# EasyEDA Pro project ProPrj_Circular_Weaving_2025-12-15.epro

# Schematic Schematic1
Board Name: Board1; Create Date: 2025-12-03; Page Name: P1; Project Name: Circular_Weaving; Schematic Name: Schematic1; Update Date: 2025-12-14; Company: 嘉立创EDA; Page Size: A4; Version: V1.0
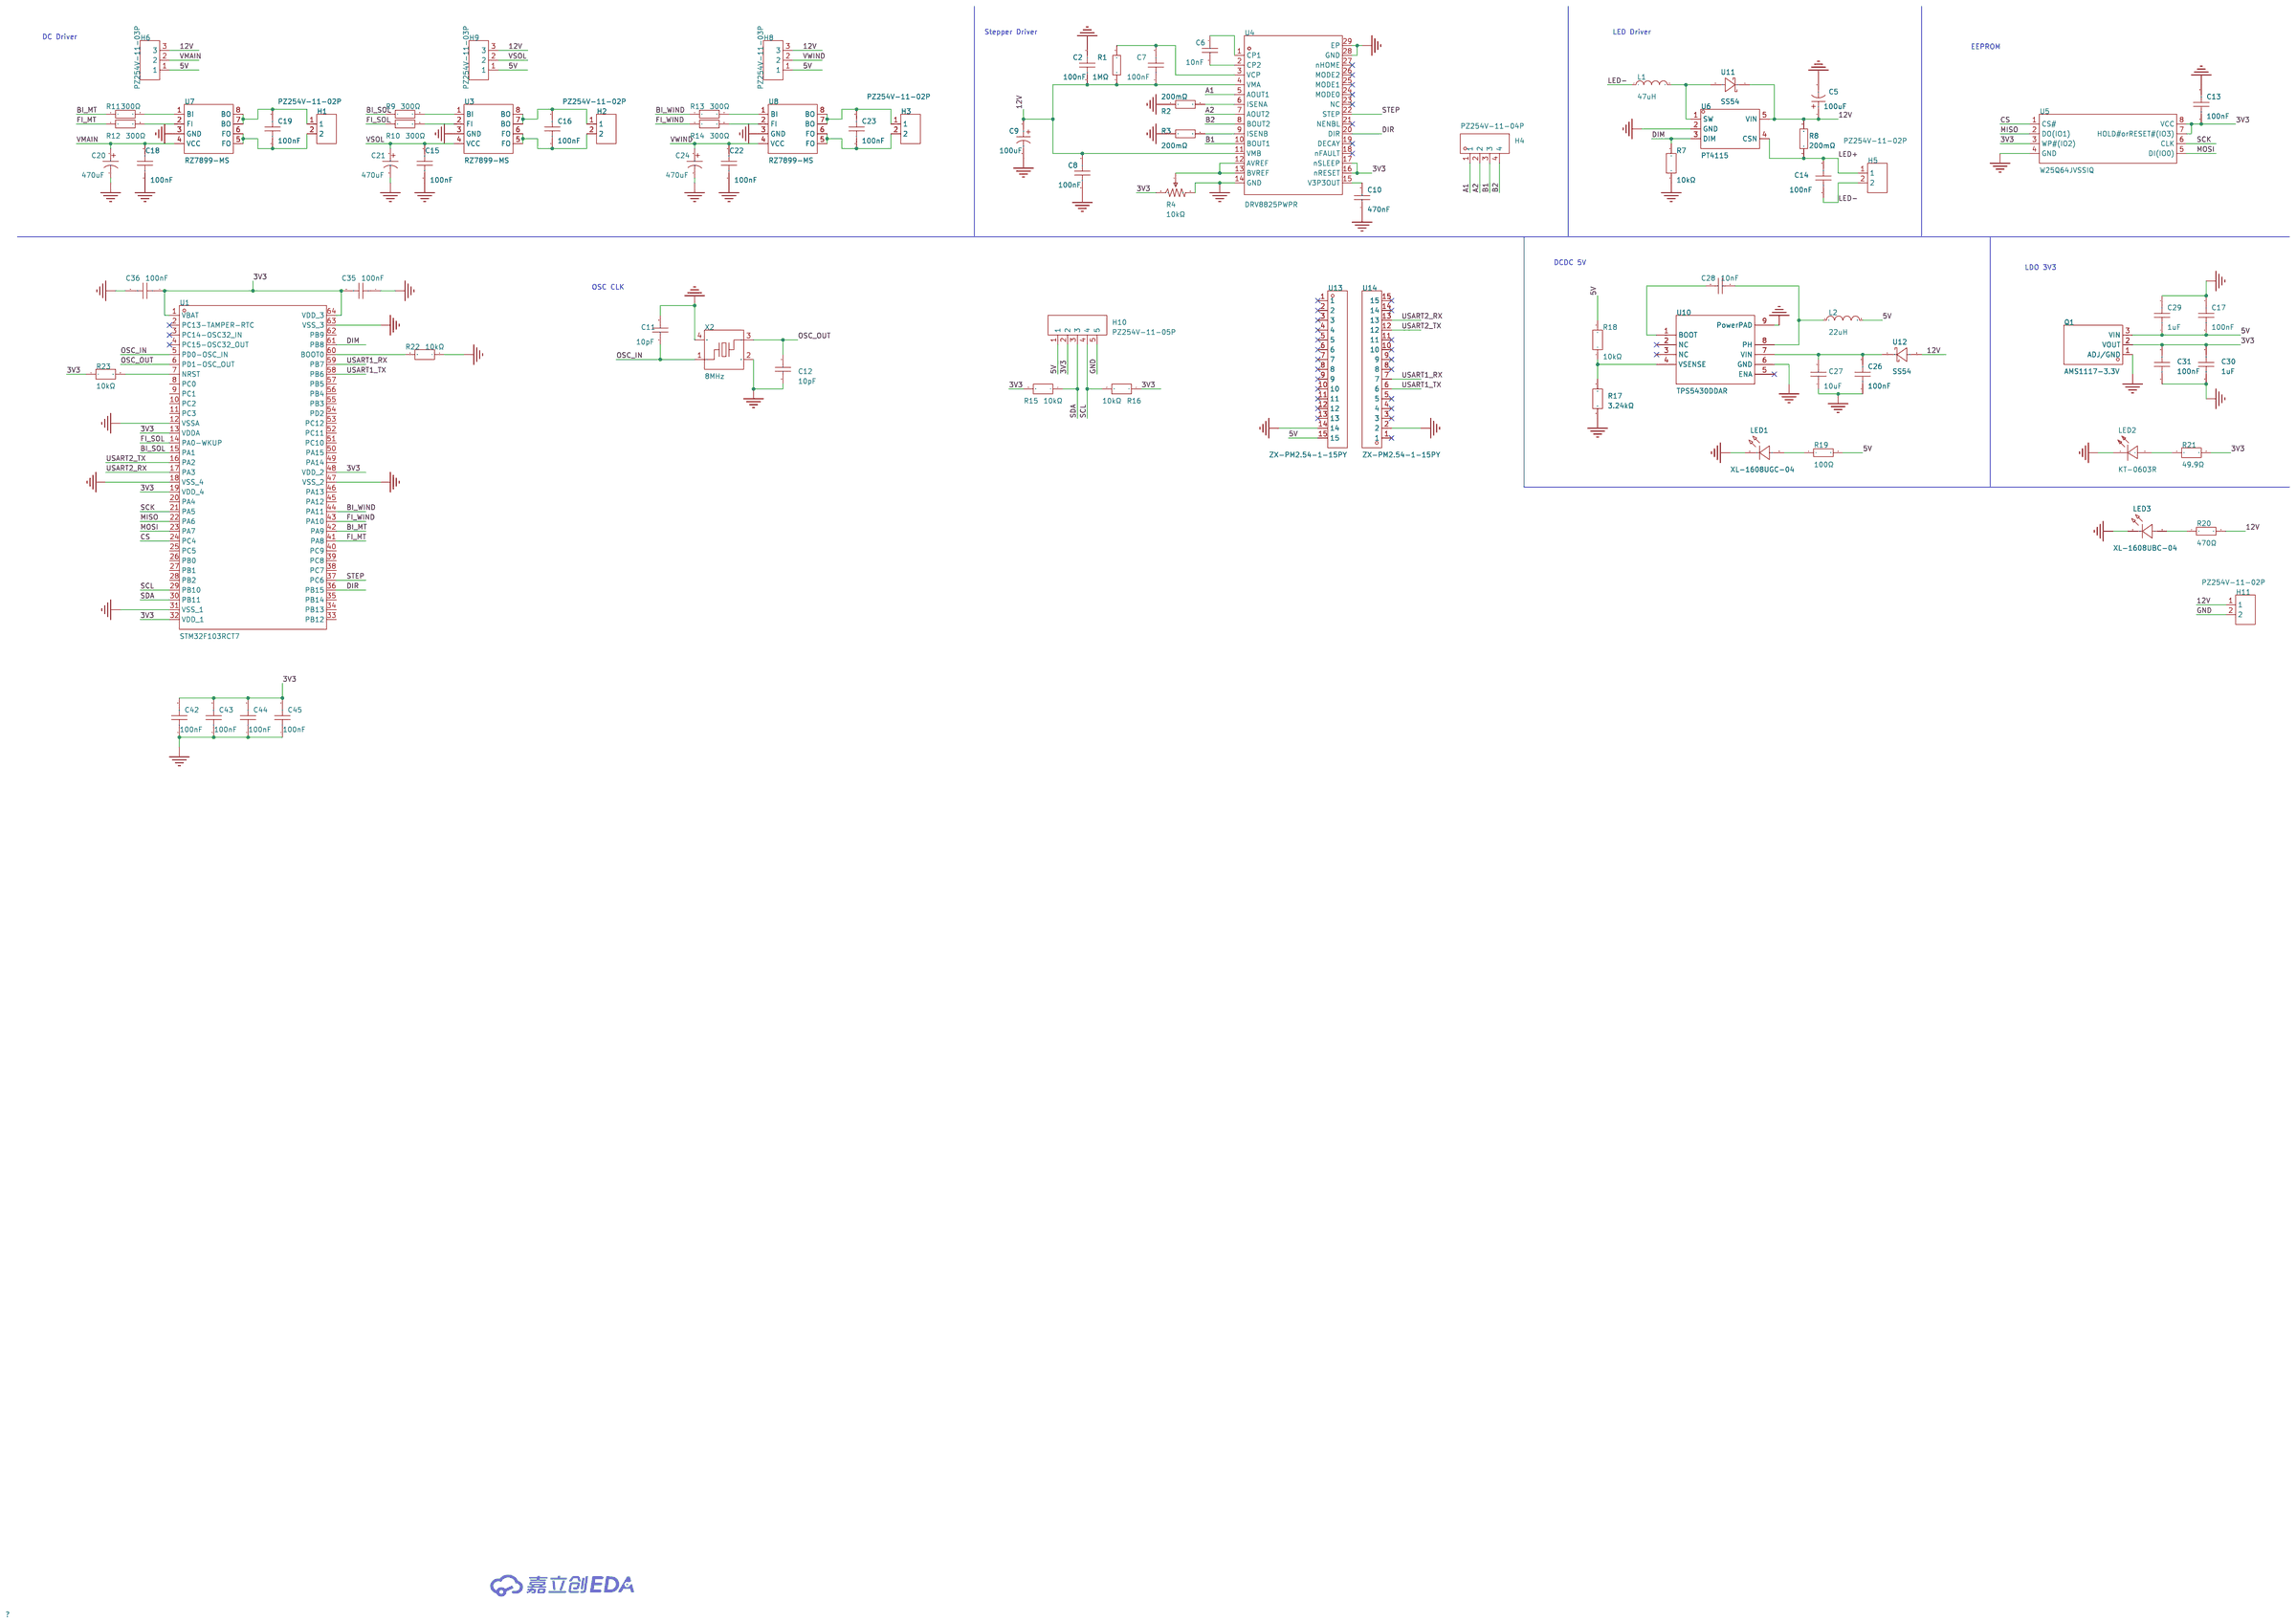
[diagram p0: schematic sheet]

## Parts
C2  100nF  [C0603]
C5  100uF  [CAP-SMD_BD6.3-L6.6-W6.6-LS7.3-FD-H7.7]
C6  10nF  [C0603]
C7  100nF  [C0603]
C8  100nF  [C0603]
C9  100uF  [CAP-SMD_BD6.3-L6.6-W6.6-LS7.3-FD-H7.7]
C10  470nF  [C0603]
C11  10pF  [C0603]
C12  10pF  [C0603]
C13  100nF  [C0603]
C14  100nF  [C0603]
C15  100nF  [C0603]
C16  100nF  [C0603]
C17  100nF  [C0603]
C18  100nF  [C0603]
C19  100nF  [C0603]
C20  470uF  [CAP-SMD_BD10.0-L10.3-W10.3-LS11.0-R-RD]
C21  470uF  [CAP-SMD_BD10.0-L10.3-W10.3-LS11.0-R-RD]
C22  100nF  [C0603]
C23  100nF  [C0603]
C24  470uF  [CAP-SMD_BD10.0-L10.3-W10.3-LS11.0-R-RD]
C26  100nF  [C0603]
C27  10uF  [C1206]
C28  10nF  [C0603]
C29  1uF  [C0603]
C30  1uF  [C0603]
C31  100nF  [C0603]
C35  100nF  [C0603]
C36  100nF  [C0603]
C42  100nF  [C0603]
C43  100nF  [C0603]
C44  100nF  [C0603]
C45  100nF  [C0603]
H1  PZ254V-11-02P  [HDR-TH_2P-P2.54-V-M]
H2  PZ254V-11-02P  [HDR-TH_2P-P2.54-V-M]
H3  PZ254V-11-02P  [HDR-TH_2P-P2.54-V-M]
H4  PZ254V-11-04P  [HDR-TH_4P-P2.54-V-M]
H5  PZ254V-11-02P  [HDR-TH_2P-P2.54-V-M]
H6  PZ254V-11-03P  [HDR-TH_3P-P2.54-V-M]
H8  PZ254V-11-03P  [HDR-TH_3P-P2.54-V-M]
H9  PZ254V-11-03P  [HDR-TH_3P-P2.54-V-M]
H10  PZ254V-11-05P  [HDR-TH_5P-P2.54-V-M]
H11  PZ254V-11-02P  [HDR-TH_2P-P2.54-V-M]
L1  47uH  [IND-SMD_L7.0-W6.6_FXL0630]
L2  22uH  [IND-SMD_L7.1-W6.6]
LED1  XL-1608UGC-04  [LED0603-RD_GREEN]
LED2  KT-0603R  [LED0603-RD]
LED3  XL-1608UBC-04  [LED0603-RD_BLUE]
Q1  AMS1117-3.3V  [SOT-89-3_L4.5-W2.5-P1.50-LS4.2-BR]
R1  1MΩ  [R0603]
R2  200mΩ  [R0603]
R3  200mΩ  [R0603]
R4  10kΩ  [RES-ADJ-SMD_JER33X-1-14]
R7  10kΩ  [R0603]
R8  200mΩ  [R0603]
R9  300Ω  [R0603]
R10  300Ω  [R0603]
R11  300Ω  [R0603]
R12  300Ω  [R0603]
R13  300Ω  [R0603]
R14  300Ω  [R0603]
R15  10kΩ  [R0603]
R16  10kΩ  [R0603]
R17  3.24kΩ  [R0603]
R18  10kΩ  [R0603]
R19  100Ω  [R0603]
R20  470Ω  [R0603]
R21  49.9Ω  [R0603]
R22  10kΩ  [R0603]
R23  10kΩ  [R0603]
U1  STM32F103RCT7  [LQFP-64_L10.0-W10.0-P0.50-LS12.0-BL]
U3  RZ7899-MS  [SOIC-8_L4.9-W3.9-P1.27-LS6.0-BL]
U4  DRV8825PWPR  [HTSSOP-28_L9.7-W4.4-P0.65-LS6.4-BL-EP]
U5  W25Q64JVSSIQ  [SOIC-8_L5.3-W5.3-P1.27-LS8.0-BL]
U6  PT4115  [SOT-89-5_L4.5-W2.5-P1.50-LS4.5-BR]
U7  RZ7899-MS  [SOIC-8_L4.9-W3.9-P1.27-LS6.0-BL]
U8  RZ7899-MS  [SOIC-8_L4.9-W3.9-P1.27-LS6.0-BL]
U10  TPS5430DDAR  [ESOP-8_L4.9-W3.9-P1.27-LS6.0-TL-EP]
U11  SS54  [SMB_L4.3-W3.6-LS5.4-RD]
U12  SS54  [SMB_L4.3-W3.6-LS5.4-RD]
U13  ZX-PM2.54-1-15PY  [HDR-TH_15P-P2.54-V-F]
U14  ZX-PM2.54-1-15PY  [HDR-TH_15P-P2.54-V-F]
X2  8MHz  [CRYSTAL-SMD_4P-L3.2-W2.5-BL]

## Library data of the parts
C2 C7 C8 C13-C19 C22 C23 C26 C31 C35 C36 C42-C45 = CL10B104KB8NNNC: 容值:100nF;精度:±10%;额定电压:50V;温度系数:X7R;; LCSC Part Name: 100nF ±10% 50V; Supplier Part: C1591; Manufacturer: SAMSUNG(三星); Supplier Footprint: 0603; JLCPCB Part Class: 扩展库; Datasheet: https://item.szlcsc.com/datasheet/CL10B104KB8NNNC/1943.html; Supplier: LCSC; Tolerance: ±10%; Voltage Rating: 50V; Temperature Coefficient: X7R
C5 C9 = JVJ50V100M6x8: 容值:100uF;精度:±20%;额定电压:50V;纹波电流:140mA@120Hz;; LCSC Part Name: 100uF ±20% 50V; Supplier Part: C46550415; Manufacturer: JIERR(捷而瑞); Supplier Footprint: SMD,D6.3xL7.7mm; JLCPCB Part Class: 扩展库; Datasheet: https://item.szlcsc.com/datasheet/JVJ50V100M6x8/48680109.html; Supplier: LCSC; Tolerance: ±20%; Voltage Rating: 50V; Ripple Current: 140mA@120Hz; Diameter: 6.3mm; Height - Seated (Max): 7.7mm; Lifetime: 2000hrs@105℃; Operating Temperature: -55℃~+105℃
C6 C28 = CC0603KRX7R9BB103: 容值:10nF;精度:±10%;额定电压:50V;温度系数:X7R;; LCSC Part Name: 10nF ±10% 50V; Supplier Part: C100042; Manufacturer: YAGEO(国巨); Supplier Footprint: 0603; JLCPCB Part Class: 扩展库; Datasheet: https://item.szlcsc.com/datasheet/CC0603KRX7R9BB103/101256.html; Supplier: LCSC; Tolerance: ±10%; Voltage Rating: 50V; Temperature Coefficient: X7R
C10 = CL10B474KA8NNNC: 容值:470nF;精度:±10%;额定电压:25V;温度系数:X7R;; LCSC Part Name: 470nF ±10% 25V; Supplier Part: C1623; Manufacturer: SAMSUNG(三星); Supplier Footprint: 0603; JLCPCB Part Class: 基础库; Datasheet: https://item.szlcsc.com/datasheet/CL10B474KA8NNNC/1975.html; Supplier: LCSC; Tolerance: ±10%; Voltage Rating: 25V; Temperature Coefficient: X7R
C11 C12 = CL10C100JB8NNNC: 容值:10pF;精度:±5%;额定电压:50V;温度系数:C0G;; LCSC Part Name: 10pF ±5% 50V; Supplier Part: C1634; Manufacturer: SAMSUNG(三星); Supplier Footprint: 0603; JLCPCB Part Class: 基础库; Datasheet: https://item.szlcsc.com/datasheet/CL10C100JB8NNNC/1986.html; Supplier: LCSC; Tolerance: ±5%; Voltage Rating: 50V; Temperature Coefficient: C0G
C20 C21 C24 = RVT1V471M1010_C72519: 容值:470uF;精度:±20%;额定电压:35V;纹波电流:286mA@120Hz;等效串联电阻(ESR):-;; LCSC Part Name: 470uF ±20% 35V; Supplier Part: C72519; Manufacturer: ROQANG(容强); Manufacturer Part: RVT1V471M1010; Supplier Footprint: SMD,D10xL10.2mm; Datasheet: https://atta.szlcsc.com/upload/public/pdf/source/20210128/C72519_A1B8ED607B11AD36B70B1D23AFC8819E.pdf; Supplier: LCSC; Tolerance: ±20%; Voltage Rating: 35V; Ripple Current: 286mA@120Hz; Diameter: 10mm; Height - Seated (Max): 10.2mm; Lifetime: 2000hrs@105℃; Operating Temperature: -40℃~+105℃
C27 = CL31A106KBHNNNE: 容值:10uF;精度:±10%;额定电压:50V;温度系数:X5R;; LCSC Part Name: 10uF ±10% 50V; Supplier Part: C13585; Manufacturer: SAMSUNG(三星); Supplier Footprint: 1206; JLCPCB Part Class: 基础库; Datasheet: https://item.szlcsc.com/datasheet/CL31A106KBHNNNE/14236.html; Supplier: LCSC; Tolerance: ±10%; Voltage Rating: 50V; Temperature Coefficient: X5R
C29 C30 = CL10A105KB8NNNC: 容值:1uF;精度:±10%;额定电压:50V;温度系数:X5R;; LCSC Part Name: 1uF ±10% 50V; Supplier Part: C15849; Manufacturer: SAMSUNG(三星); Supplier Footprint: 0603; JLCPCB Part Class: 基础库; Datasheet: https://item.szlcsc.com/datasheet/CL10A105KB8NNNC/16531.html; Supplier: LCSC; Tolerance: ±10%; Voltage Rating: 50V; Temperature Coefficient: X5R
H1-H3 H5 H11 = PZ254V-11-02P: 插针结构:1x2P;间距:2.54mm;行距:-;圆针/方针:方针;安装方式:直插;排数:单排;总PIN位数:2P;额定电流:-;额定电压:-;配合针长度:6mm;塑高:2.5mm;端接针长度:3mm;触头材质:黄铜;触头镀层:-;工作温度:-40℃~+105℃;颜色:黑色;; LCSC Part Name: 1x2P 间距:2.54mm 方针 直插; Supplier Part: C492401; Manufacturer: XFCN(兴飞); Supplier Footprint: 插件,P=2.54mm; JLCPCB Part Class: 扩展库; Datasheet: https://item.szlcsc.com/datasheet/PZ254V-11-02P/502957.html; Supplier: LCSC; Pin Structure: 1x2P; Pitch: 2.54mm; Circluar Pins/Square Pins: 方针; Mounting Type: 直插; Number of Rows: 单排; Number of Pins: 2P; Length of Mating Pin: 6mm; Insulation Height: 2.5mm; Length of End Connection Pin: 3mm; Contact Material: 黄铜; Operating Temperature: -40℃~+105℃; Color: 黑色
H4 = PZ254V-11-04P: 插针结构:1x4P;间距:2.54mm;行距:-;圆针/方针:方针;安装方式:直插;排数:单排;总PIN位数:4P;额定电流:3A;额定电压:250V;配合针长度:6mm;塑高:2.5mm;端接针长度:3mm;触头材质:-;工作温度:-40℃~+105℃;颜色:黑色;; LCSC Part Name: 1x4P 间距:2.54mm 方针 直插; Supplier Part: C2691448; Manufacturer: XFCN(兴飞); Supplier Footprint: 插件,P=2.54mm; JLCPCB Part Class: 扩展库; Datasheet: https://item.szlcsc.com/datasheet/PZ254V-11-04P/2801085.html; Supplier: LCSC; Pin Structure: 1x4P; Pitch: 2.54mm; Circluar Pins/Square Pins: 方针; Mounting Type: 直插; Number of Rows: 单排; Number of Pins: 4P; Current Rating: 3A; Voltage Rating (Max): 250V; Length of Mating Pin: 6mm; Insulation Height: 2.5mm; Length of End Connection Pin: 3mm; Operating Temperature: -40℃~+105℃; Color: 黑色
H6 H8 H9 = PZ254V-11-03P: 插针结构:1x3P;间距:2.54mm;行距:-;圆针/方针:方针;安装方式:直插;排数:单排;总PIN位数:3P;额定电流:3A;额定电压:250V;配合针长度:6mm;塑高:2.5mm;端接针长度:3mm;工作温度:-40℃~+105℃;颜色:黑色;; LCSC Part Name: 1x3P 间距:2.54mm 方针 直插; Supplier Part: C2937625; Manufacturer: XFCN(兴飞); Supplier Footprint: 插件,P=2.54mm; JLCPCB Part Class: 扩展库; Datasheet: https://item.szlcsc.com/datasheet/PZ254V-11-03P/3293280.html; Supplier: LCSC; Pin Structure: 1x3P; Pitch: 2.54mm; Circluar Pins/Square Pins: 方针; Mounting Type: 直插; Number of Rows: 单排; Number of Pins: 3P; Current Rating: 3A; Voltage Rating (Max): 250V; Length of Mating Pin: 6mm; Insulation Height: 2.5mm; Length of End Connection Pin: 3mm; Operating Temperature: -40℃~+105℃; Color: 黑色
H10 = PZ254V-11-05P: 插针结构:1x5P;间距:2.54mm;行距:-;圆针/方针:方针;安装方式:直插;排数:单排;总PIN位数:5P;额定电流:-;额定电压:-;配合针长度:6mm;塑高:2.5mm;端接针长度:3mm;触头材质:黄铜;触头镀层:-;工作温度:-40℃~+105℃;颜色:黑色;; LCSC Part Name: 1x5P 间距:2.54mm 方针 直插; Supplier Part: C492404; Manufacturer: XFCN(兴飞); Supplier Footprint: 插件,P=2.54mm; JLCPCB Part Class: 扩展库; Datasheet: https://item.szlcsc.com/datasheet/PZ254V-11-05P/502960.html; Supplier: LCSC; Pin Structure: 1x5P; Pitch: 2.54mm; Circluar Pins/Square Pins: 方针; Mounting Type: 直插; Number of Rows: 单排; Number of Pins: 5P; Length of Mating Pin: 6mm; Insulation Height: 2.5mm; Length of End Connection Pin: 3mm; Contact Material: 黄铜; Operating Temperature: -40℃~+105℃; Color: 黑色
L1 = FXL0630-470-M: 电感值:47uH;精度:±20%;额定电流:1.5A;饱和电流(Isat):2A;类型:一体成型电感;; LCSC Part Name: 47uH ±20% 2A; Supplier Part: C475913; Manufacturer: cjiang(长江微电); Supplier Footprint: SMD,6.6x7mm; JLCPCB Part Class: 扩展库; Datasheet: https://atta.szlcsc.com/upload/public/pdf/source/20240426/3189EA8206330E2108542F9E34E540E7.pdf; Supplier: LCSC; Tolerance: ±20%; Rated Current: 1.5A; Saturation Current (Isat): 2A; DC Resistance (DCR): 385mΩ; Type: 一体成型电感
L2 = YSPI0630A-220M: 电感值:22uH;精度:±20%;额定电流:3A;类型:一体成型电感;; LCSC Part Name: 22uH ±20%; Supplier Part: C497873; Manufacturer: YJYCOIN(益嘉源); Supplier Footprint: SMD,7.1x6.6mm; JLCPCB Part Class: 扩展库; Datasheet: https://item.szlcsc.com/datasheet/YSPI0630A-220M/509518.html; Supplier: LCSC; Tolerance: ±20%; Current Rating: 3A; DC Resistance(DCR): 130mΩ; Type: 一体成型电感
LED1 = XL-1608UGC-04: 灯头类型:-;发光颜色:翠绿色;正向压降(Vf):3.3V;功率:70mW;正向电流:20mA;波长:515nm~535nm;二极管配置:独立二极管;透镜颜色:无色透明透镜;色温:-;发光强度:810mcd;发光角度:120°;载带方式:正贴;工作温度:-40℃~+85℃;; LCSC Part Name: 0603翠绿贴片式发光二极管; Supplier Part: C965804; Manufacturer: XINGLIGHT(成兴光); Supplier Footprint: 0603; JLCPCB Part Class: 扩展库; Datasheet: https://item.szlcsc.com/datasheet/XL-1608UGC-04/1051413.html; Supplier: LCSC; Illumination Color: 翠绿色; Voltage - Forward(Vf): 3.3V; Power(Watts): 70mW; Forward Current: 20mA; Wavelength - Dominant: 515nm~535nm; Peak Wavelength: 525nm; Diode Configuration: 独立二极管; Lens Color: 无色透明透镜; Luminous Intensity: 810mcd; Viewing Angle: 120°; Mounting Style: 正贴; Operating Temperature: -40℃~+85℃
LED2 = KT-0603R: 发光颜色:红色;功率:-;正向电流:-;主波长:-;二极管配置:-;透镜颜色:-;色温:-;发光角度:-;载带方式:-;工作温度:-40℃~+85℃;; LCSC Part Name: 0603 红灯 高亮; Supplier Part: C2286; Manufacturer: KENTO; Supplier Footprint: 0603; JLCPCB Part Class: 基础库; Datasheet: https://atta.szlcsc.com/upload/public/pdf/source/20160616/1466072038404.pdf; Supplier: LCSC; Emitted Color: 红色; Operating Temperature: -40℃~+85℃
LED3 = XL-1608UBC-04: 灯头类型:-;发光颜色:蓝色;正向压降(Vf):3.3V;功率:70mW;正向电流:20mA;波长:455nm~475nm;二极管配置:-;透镜颜色:无色透明透镜;色温:-;发光强度:300mcd;发光角度:120°;载带方式:正贴;工作温度:-;; LCSC Part Name: 0603蓝色贴片式发光二极管; Supplier Part: C965807; Manufacturer: XINGLIGHT(成兴光); Supplier Footprint: 0603; JLCPCB Part Class: 扩展库; Datasheet: https://item.szlcsc.com/datasheet/XL-1608UBC-04/1051416.html; Supplier: LCSC; Illumination Color: 蓝色; Voltage - Forward(Vf): 3.3V; Power(Watts): 70mW; Forward Current: 20mA; Wavelength - Dominant: 455nm~475nm; Peak Wavelength: 470nm; Lens Color: 无色透明透镜; Luminous Intensity: 300mcd; Viewing Angle: 120°; Mounting Style: 正贴
Q1 = AMS1117-3.3V_C5120796: 输出类型:固定;工作电压:18V;输出电压:3.3V;输出电流:1A;输出极性:正极;; LCSC Part Name: 输入18V 输出3.3V 1A; Supplier Part: C5120796; Manufacturer: MSKSEMI(美森科); Supplier Footprint: SOT-89; JLCPCB Part Class: 扩展库; Datasheet: https://item.szlcsc.com/datasheet/AMS1117-3.3V/5706251.html; Supplier: LCSC; Output Type: 固定; Voltage - Supply: 18V; Output Voltage: 3.3V; Output Current: 1A; Voltage Dropout: 1.4V@(1A); standby current: 12mA; Operating Temperature: 0℃~+125℃; Output Configuration: 正极; Number of Outputs: 1
R1 = 0603WAF1004T5E: 电阻类型:厚膜电阻;阻值:1MΩ;精度:±1%;功率:100mW;最大工作电压:75V;温度系数:±100ppm/℃;; LCSC Part Name: 1MΩ ±1% 100mW 厚膜电阻; Supplier Part: C22935; Manufacturer: UNI-ROYAL(厚声); Supplier Footprint: 0603; JLCPCB Part Class: 基础库; Datasheet: https://atta.szlcsc.com/upload/public/pdf/source/20200306/C422600_1E6D84923E4A46A82E41ADD87F860B5C.pdf; Supplier: LCSC; Type: 厚膜电阻; Tolerance: ±1%; Power(Watts): 100mW; Overload Voltage (Max): 75V; Temperature Coefficient: ±100ppm/℃; Operating Temperature Range: -55℃~+155℃
R2 R3 R8 = 0603WAF200LT5E: 电阻类型:厚膜电阻;阻值:200mΩ;精度:±1%;功率:100mW;工作电压:75V;温度系数:±800ppm/℃;; LCSC Part Name: 200mΩ ±1% 100mW 厚膜电阻; Supplier Part: C79773; Manufacturer: UNI-ROYAL(厚声); Supplier Footprint: 0603; JLCPCB Part Class: 扩展库; Datasheet: https://item.szlcsc.com/datasheet/0603WAF200LT5E/80916.html; Supplier: LCSC; Type: 厚膜电阻; Tolerance: ±1%; Power(Watts): 100mW; Voltage-Supply(Max): 75V; Temperature Coefficient: ±800ppm/℃; Operating Temperature: -55℃~+155℃
R4 = JER33X-1-14: 阻值:10kΩ;精度:±25%;功率:150mW;温度系数:±250ppm/℃;; Supplier Part: C48997896; Manufacturer: JIERR(捷而瑞); Supplier Footprint: SMD-3P,3.4x3.1mm; JLCPCB Part Class: 扩展库; Datasheet: https://item.szlcsc.com/datasheet/JER33X-1-14/51342032.html; Supplier: LCSC; Tolerance: ±25%; Power(Watts): 150mW; Temperature Coefficient: ±250ppm/℃; Number of Turns: 1
R7 R15 R16 R18 R22 R23 = FRC0603J103 TS: 电阻类型:厚膜电阻;阻值:10kΩ;精度:±5%;功率:100mW;工作电压:75V;温度系数:±100ppm/℃;; LCSC Part Name: 10kΩ ±5% 100mW 厚膜电阻; Supplier Part: C2930027; Manufacturer: FOJAN(富捷); Supplier Footprint: 0603; JLCPCB Part Class: 扩展库; Datasheet: https://item.szlcsc.com/datasheet/FRC0603J103%2520TS/3266960.html; Supplier: LCSC; Type: 厚膜电阻; Tolerance: ±5%; Power(Watts): 100mW; Voltage-Supply(Max): 75V; Temperature Coefficient: ±100ppm/℃; Operating Temperature: -55℃~+155℃
R9-R14 = 0603WAF3000T5E: 电阻类型:厚膜电阻;阻值:300Ω;精度:±1%;功率:100mW;工作电压:75V;温度系数:±100ppm/℃;; LCSC Part Name: 300Ω ±1% 100mW 厚膜电阻; Supplier Part: C23025; Manufacturer: UNI-ROYAL(厚声); Supplier Footprint: 0603; JLCPCB Part Class: 基础库; Datasheet: https://item.szlcsc.com/datasheet/0603WAF3000T5E/23752.html; Supplier: LCSC; Type: 厚膜电阻; Tolerance: ±1%; Power(Watts): 100mW; Voltage-Supply(Max): 75V; Temperature Coefficient: ±100ppm/℃; Operating Temperature: -55℃~+155℃
R17 = FRC0603F3241TS: 电阻类型:厚膜电阻;阻值:3.24kΩ;精度:±1%;功率:100mW;工作电压:75V;温度系数:±100ppm/℃;; LCSC Part Name: 3.24kΩ ±1% 100mW 厚膜电阻; Supplier Part: C2933197; Manufacturer: FOJAN(富捷); Supplier Footprint: 0603; JLCPCB Part Class: 扩展库; Supplier: LCSC; Type: 厚膜电阻; Tolerance: ±1%; Power(Watts): 100mW; Voltage-Supply(Max): 75V; Temperature Coefficient: ±100ppm/℃; Operating Temperature: -55℃~+155℃
R19 = 0603WAF1000T5E: 电阻类型:厚膜电阻;阻值:100Ω;精度:±1%;功率:100mW;最大工作电压:75V;温度系数:±200ppm/℃;; LCSC Part Name: 100Ω ±1% 100mW 厚膜电阻; Supplier Part: C22775; Manufacturer: UNI-ROYAL(厚声); Supplier Footprint: 0603; JLCPCB Part Class: 基础库; Datasheet: https://atta.szlcsc.com/upload/public/pdf/source/20200306/C422600_1E6D84923E4A46A82E41ADD87F860B5C.pdf; Supplier: LCSC; Type: 厚膜电阻; Tolerance: ±1%; Power(Watts): 100mW; Overload Voltage (Max): 75V; Temperature Coefficient: ±200ppm/℃; Operating Temperature Range: -55℃~+155℃
R20 = 0603WAF4700T5E: 电阻类型:厚膜电阻;阻值:470Ω;精度:±1%;功率:100mW;工作电压:75V;温度系数:±100ppm/℃;; LCSC Part Name: 470Ω ±1% 100mW 厚膜电阻; Supplier Part: C23179; Manufacturer: UNI-ROYAL(厚声); Supplier Footprint: 0603; JLCPCB Part Class: 基础库; Datasheet: https://item.szlcsc.com/datasheet/0603WAF4700T5E/23906.html; Supplier: LCSC; Type: 厚膜电阻; Tolerance: ±1%; Power(Watts): 100mW; Voltage-Supply(Max): 75V; Temperature Coefficient: ±100ppm/℃; Operating Temperature: -55℃~+155℃
R21 = FRC0603F49R9TS: 电阻类型:厚膜电阻;阻值:49.9Ω;精度:±1%;功率:100mW;工作电压:75V;温度系数:±100ppm/℃;; LCSC Part Name: 49.9Ω ±1% 100mW 厚膜电阻; Supplier Part: C2930110; Manufacturer: FOJAN(富捷); Supplier Footprint: 0603; JLCPCB Part Class: 扩展库; Supplier: LCSC; Type: 厚膜电阻; Tolerance: ±1%; Power(Watts): 100mW; Voltage-Supply(Max): 75V; Temperature Coefficient: ±100ppm/℃; Operating Temperature: -55℃~+155℃
U1 = STM32F103RCT7: CPU内核:ARM-M3;CPU最大主频:72MHz;应用领域:-;; LCSC Part Name: 主流增强型ARM Cortex-M3 MCU，具有256 KB Flash、72 MHz CPU、电机控制、USB和CAN; Supplier Part: C882165; Manufacturer: ST(意法半导体); Supplier Footprint: LQFP-64(10x10); JLCPCB Part Class: 扩展库; Datasheet: https://item.szlcsc.com/datasheet/STM32F103RCT7/945876.html; Supplier: LCSC; CPU Core: ARM-M3; CPU Maximum Speed: 72MHz; Program Storage Size: 256KB; Program Memory Type: FLASH; Number of I/O: 51; ADC (Bit): 12bit; DAC (Bit): 12bit; Voltage - Supply: 2V~3.6V
U3 U7 U8 = RZ7899-MS: DC双向马达驱动芯片，采用SOP8封装，具备最大输出电流6A,工作电压3.0-30V,超低导通电阻，静态电流1UA,具有过热保护，短路保护，过流保护及紧急停止功能等。因其卓越的性能，被广泛应用于机器人、无人机、智能家居设备、电动工具、个人移动设备、玩具及各种自动化控制系统中的直流电机驱动。; Supplier Part: C22462553; Manufacturer: MSKSEMI(美森科); Supplier Footprint: SOP-8; JLCPCB Part Class: 扩展库; Datasheet: https://atta.szlcsc.com/upload/public/pdf/source/20240621/E583E2F94B562F3379D55107EB6AE7D9.pdf; Supplier: LCSC
U4 = DRV8825PWPR: DRV8825 具有电流调节功能和 1/32 微步进的 45V、2.5A 双极步进电机驱动器; LCSC Part Name: 2.5A 45V电机驱动芯片; Supplier Part: C81582; Manufacturer: TI(德州仪器); Supplier Footprint: HTSSOP-28-EP; JLCPCB Part Class: 扩展库; Datasheet: https://www.ti.com/cn/lit/gpn/drv8825; Supplier: LCSC; Interface: STEP/DIR; Step Resolution: 32; RDS(on): 200mΩ; Operating Temperature: -40℃~+85℃
U5 = W25Q64JVSSIQ: 接口类型:SPI;存储容量:64Mbit;时钟频率(fc):133MHz;; LCSC Part Name: 支持双线、四线SPI接口的3V 64Mbit 串行闪存; Supplier Part: C179171; Manufacturer: Winbond(华邦); Supplier Footprint: SOIC-8-208mil; JLCPCB Part Class: 扩展库; Datasheet: https://item.szlcsc.com/datasheet/W25Q64JVSSIQ/190565.html; Supplier: LCSC; Interface: SPI; Memory Size: 64Mbit; Clock Frequency: 133MHz; Voltage - Supply: 2.7V~3.6V; Program / Erase Cycles: 100000次; Page Programming Time (Tpp): 3ms; Block Erase Time(tBE): 150ms@(64KB); Data Retention - TDR (Year): 20年
U6 = PT4115_C347356: 类型:-;输入电压:-;开关频率:-;通道数:-;输出电压:-;输出电流:-;调光:-;; Supplier Part: C347356; Manufacturer: UMW(友台半导体); Supplier Footprint: SOT-89-5; JLCPCB Part Class: 扩展库; Datasheet: https://atta.szlcsc.com/upload/public/pdf/source/20241025/03C13C0029ED384DE85B3A39B3F7BBBE.pdf; Supplier: LCSC
U10 = TPS5430DDAR: 功能类型:降压型;工作电压:5.5V~36V;输出电压:1.221V~32.04V;输出电流:3A;输出类型:可调;; LCSC Part Name: 宽输入范围、3A输出电流的降压转换器; Supplier Part: C9864; Manufacturer: TI(德州仪器); Supplier Footprint: SOIC-8-EP; JLCPCB Part Class: 基础库; Datasheet: https://www.ti.com/lit/ds/symlink/tps5430.pdf; Supplier: LCSC; Function: 降压型; Voltage - Supply: 5.5V~36V; Output Voltage: 1.221V~32.04V; Output Current: 3A; Frequency - Switching: 500kHz; Operating Temperature: -40℃~+125℃@(TJ); Synchronous Rectifier: 否; Number of Outputs: 1; Topology: 降压式; Quiescent Current: 4.4mA; Switch tube (built-in/external): 内置; Output Type: 可调
U11 U12 = SS54_C5200096: 二极管配置:独立式;正向压降(Vf):550mV@5A;直流反向耐压(Vr):40V;整流电流:5A;; LCSC Part Name: IF:5A VR:40V VF:0.55V IFSM:150A; Supplier Part: C5200096; Manufacturer: HXY MOSFET(华轩阳电子); Supplier Footprint: SMB; JLCPCB Part Class: 扩展库; Datasheet: https://item.szlcsc.com/datasheet/SS54/5888311.html; Supplier: LCSC; Diode Configuration: 独立式; Voltage - Forward(Vf@If): 550mV@5A; Voltage - DC Reverse(Vr): 40V; Current - Rectified: 5A; Reverse Leakage Current (Ir): 500uA; Operating Junction Temperature Range: -55℃~+125℃; Non-Repetitive Peak Forward Surge Current: 150A
U13 U14 = ZX-PM2.54-1-15PY: 插孔结构:1x15P;间距:2.54mm;行距:-;圆孔/方孔:方孔;安装方式:直插;排数:单排;总孔位数:15P;额定电流:3A;额定电压:-;插孔方向:顶部;塑高:8.5mm;触头材质:黄铜;触头镀层:金;工作温度:-40℃~+105℃;; LCSC Part Name: 1x15P 间距:2.54mm 直插; Supplier Part: C7499333; Manufacturer: Megastar(兆星); Supplier Footprint: 插件,P=2.54mm; JLCPCB Part Class: 扩展库; Datasheet: https://item.szlcsc.com/datasheet/ZX-PM2.54-1-15PY/8573994.html; Supplier: LCSC; Holes Structure: 1x15P; Pitch: 2.54mm; Circular Hole / Square Hole: 方孔; Mounting Type: 直插; Number of Rows: 单排; Number of Positions: 15P; Current Rating: 3A; Holes Direction: 顶部; Insulation Height: 8.5mm; Contact Material: 黄铜; Contact Plating: 金; Operating Temperature: -40℃~+105℃; PIN Length: 3.2mm
X2 = XL2EL89CSI-KPIYLC-8M: 晶振类型:贴片晶振;频率:8MHz;常温频差:±10ppm;负载电容:20pF;频率稳定度:±20ppm;; LCSC Part Name: YSX321SL 8MHZ 4P 3225 20PF ±10PPM -40~85℃ (±20PPM); Supplier Part: C42400161; Manufacturer: YXC(扬兴晶振); Supplier Footprint: SMD3225-4P; JLCPCB Part Class: 扩展库; Datasheet: https://item.szlcsc.com/datasheet/XL2EL89CSI-KPIYLC-8M/44352056.html; Supplier: LCSC; Type: 贴片晶振; Normal temperature Frequency Tolerance: ±10ppm; Load Capacitance: 20pF; Frequency Stability: ±20ppm; Operating Temperature: -40℃~+85℃

## Nets
3V3: C13.1 C30.1 C31.2 C35.2 C36.1 C42.2 C43.2 C44.2 C45.2 H10.2 Q1.2(VOUT) R4.3 R15.2 R16.1 R21.2 R23.1 U1.1(VBAT) U1.13(VDDA) U1.19(VDD_4) U1.32(VDD_1) U1.48(VDD_2) U1.64(VDD_3) U4.16(nRESET) U4.17(nSLEEP) U5.3(WP#(IO2)) U5.7(HOLD#orRESET#(IO3)) U5.8(VCC)
5V: C17.2 C29.1 H6.1 H8.1 H9.1 H10.1 L2.2 Q1.3(VIN) R18.2 R19.2 U13.15
12V: C2.2 C5.1 C7.1 C8.1 C9.1 H6.3 H8.3 H9.3 H11.1 R1.1 R8.2 R20.2 U4.4(VMA) U4.11(VMB) U6.5(VIN) U11.1 U12.2
GND: C2.1 C5.2 C8.2 C9.2 C10.1 C11.2 C12.1 C13.2 C15.1 C17.1 C18.1 C20.2 C21.2 C22.1 C24.2 C26.1 C27.1 C29.2 C30.2 C31.1 C35.1 C36.2 C42.1 C43.1 C44.1 C45.1 H10.5 H11.2 LED1.1(K) LED2.1(K) LED3.1(K) Q1.1(ADJ/GND) R2.1 R3.1 R4.1 R7.1 R17.1 R22.1 U1.12(VSSA) U1.18(VSS_4) U1.31(VSS_1) U1.47(VSS_2) U1.63(VSS_3) U3.3(GND) U4.14(GND) U4.28(GND) U4.29(EP) U5.4(GND) U6.2(GND) U7.3(GND) U8.3(GND) U10.6(GND) U10.9(PowerPAD) U13.14 U14.2 X2.2(GND) X2.4(GND)
A1: H4.1 U4.5(AOUT1)
A2: H4.2 U4.7(AOUT2)
B1: H4.3 U4.10(BOUT1)
B2: H4.4 U4.8(BOUT2)
BI_MT: R11.1 U1.42(PA9)
BI_SOL: R9.1 U1.15(PA1)
BI_WIND: R13.1 U1.44(PA11)
CS: U1.24(PC4) U5.1(CS#)
DIM: R7.2 U1.61(PB8) U6.3(DIM)
DIR: U1.36(PB15) U4.20(DIR)
FI_MT: R12.1 U1.41(PA8)
FI_SOL: R10.1 U1.14(PA0-WKUP)
FI_WIND: R14.1 U1.43(PA10)
LED+: C14.2 H5.1 R8.1 U6.4(CSN)
LED-: C14.1 H5.2 L1.1
MISO: U1.22(PA6) U5.2(DO(IO1))
MOSI: U1.23(PA7) U5.5(DI(IO0))
OSC_IN: C11.1 U1.5(PD0-OSC_IN) X2.1
OSC_OUT: C12.2 U1.6(PD1-OSC_OUT) X2.3
SCK: U1.21(PA5) U5.6(CLK)
SCL: H10.4 R16.2 U1.29(PB10)
SDA: H10.3 R15.1 U1.30(PB11)
STEP: U1.37(PC6) U4.22(STEP)
USART1_RX: U1.59(PB7) U14.7
USART1_TX: U1.58(PB6) U14.6
USART2_RX: U1.17(PA3) U14.13
USART2_TX: U1.16(PA2) U14.12
VMAIN: C18.2 C20.1 H6.2 U7.4(VCC)
VSOL: C15.2 C21.1 H9.2 U3.4(VCC)
VWIND: C22.2 C24.1 H8.2 U8.4(VCC)
$1N2321: C6.2 U4.2(CP2)
$1N2325: C6.1 U4.1(CP1)
$1N2438: C7.2 R1.2 U4.3(VCP)
$1N2602: R2.2 U4.6(ISENA)
$1N2668: R3.2 U4.9(ISENB)
$1N2883: R4.2 U4.12(AVREF) U4.13(BVREF)
$1N3097: C10.2 U4.15(V3P3OUT)
$1N4023: L1.2 U6.1(SW) U11.2
$1N5275: R10.2 U3.2(FI)
$1N5279: R9.2 U3.1(BI)
$1N5285: C16.2 H2.1 U3.7(BO) U3.8(BO)
$1N5289: C16.1 H2.2 U3.5(FO) U3.6(FO)
$1N5836: R12.2 U7.2(FI)
$1N5842: C19.1 H1.2 U7.5(FO) U7.6(FO)
$1N5850: C19.2 H1.1 U7.7(BO) U7.8(BO)
$1N5858: R11.2 U7.1(BI)
$1N7602: C23.1 H3.2 U8.5(FO) U8.6(FO)
$1N7604: C23.2 H3.1 U8.7(BO) U8.8(BO)
$1N7613: R13.2 U8.1(BI)
$1N7614: R14.2 U8.2(FI)
$1N13952: C26.2 C27.2 U10.7(VIN) U12.1
$1N14177: C28.2 L2.1 U10.8(PH)
$1N14184: C28.1 U10.1(BOOT)
$1N14425: R17.2 R18.1 U10.4(VSENSE)
$1N14788: LED1.2(A) R19.1
$1N17021: LED3.2(A) R20.1
$1N17109: LED2.2(A) R21.1
$1N17385: R22.2 U1.60(BOOT0)
$1N21131: R23.2 U1.7(NRST)

Not connected (* = marked no-connect by the designer): U1 2(PC13-TAMPER-RTC)* 3(PC14-OSC32_IN)* 4(PC15-OSC32_OUT)* 8(PC0) 9(PC1) 10(PC2) 11(PC3) 20(PA4) 25(PC5) 26(PB0) 27(PB1) 28(PB2) 33(PB12) 34(PB13) 35(PB14) 38(PC7) 39(PC8) 40(PC9) 45(PA12) 46(PA13) 49(PA14) 50(PA15) 51(PC10) 52(PC11) 53(PC12) 54(PD2) 55(PB3) 56(PB4) 57(PB5) 62(PB9); U4 18(nFAULT)* 19(DECAY)* 21(NENBL)* 23(NC)* 24(MODE0)* 25(MODE1)* 26(MODE2)* 27(nHOME)*; U10 2(NC)* 3(NC)* 5(ENA)*; U13 1* 2* 3* 4* 5* 6* 7* 8* 9* 10* 11* 12* 13*; U14 1* 3* 4* 5* 8* 9* 10* 11* 14* 15*

## Notes on the sheet
- DC Driver
- Stepper Driver
- LED Driver
- EEPROM
- DCDC 5V
- LDO 3V3
- OSC CLK

# Board PCB1
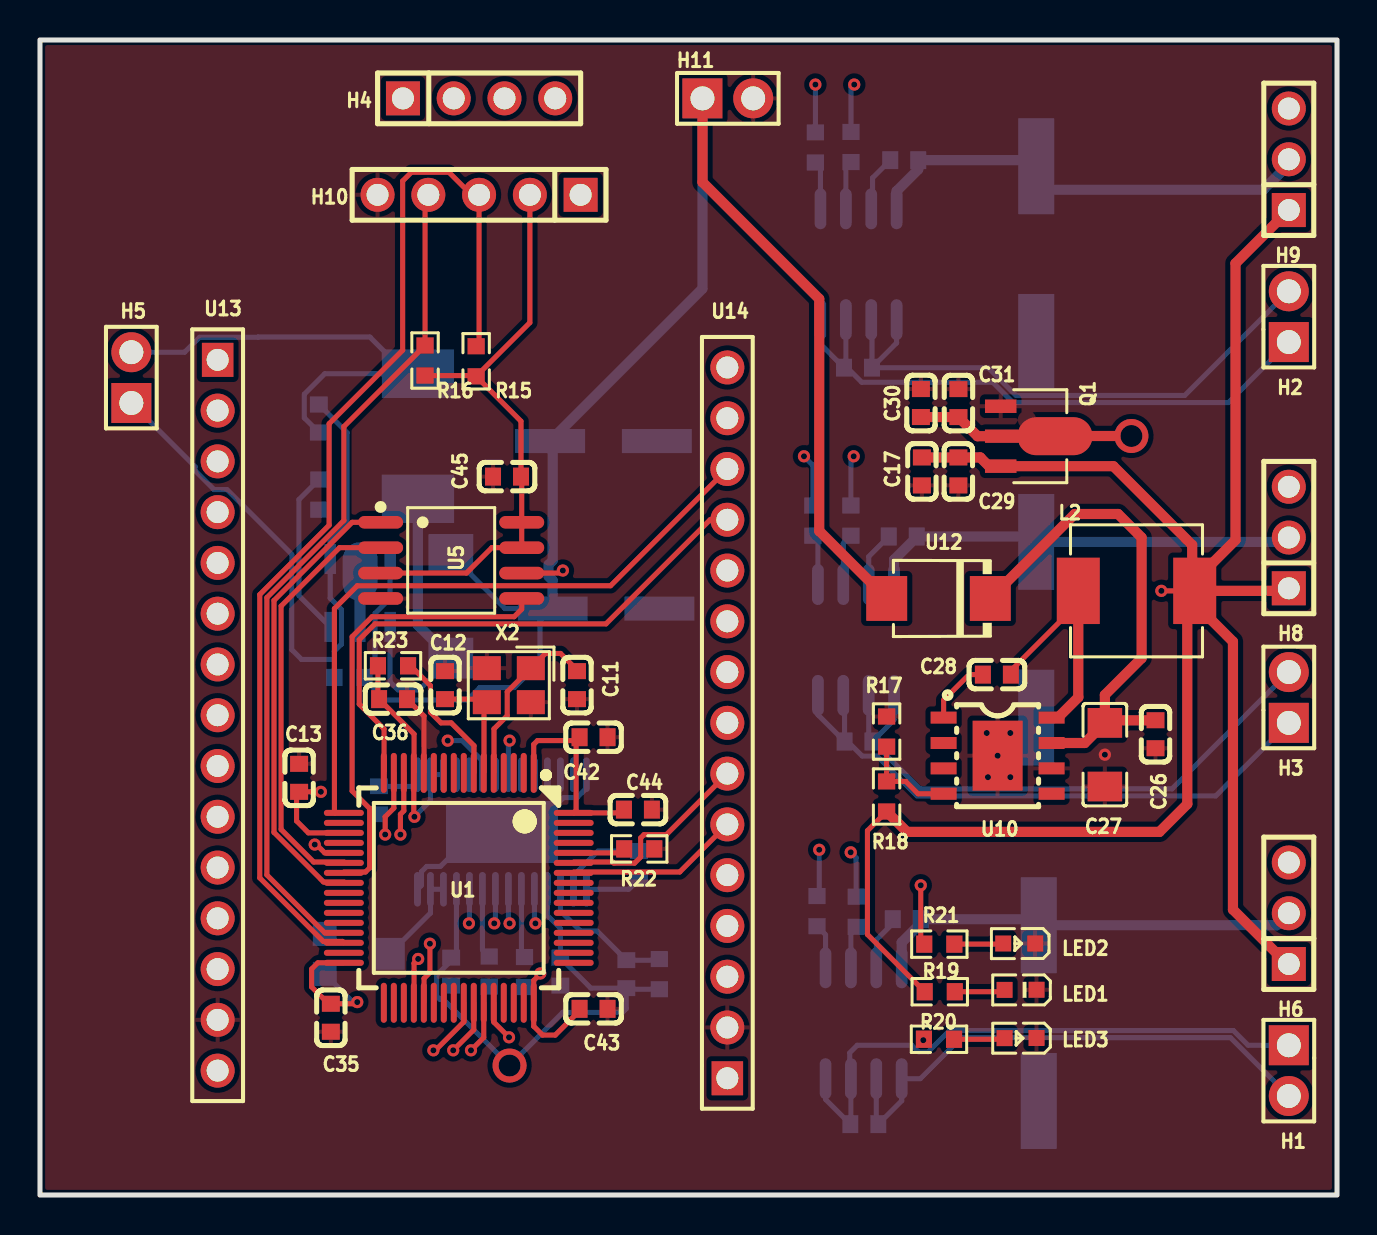
[diagram p1: board, top side]
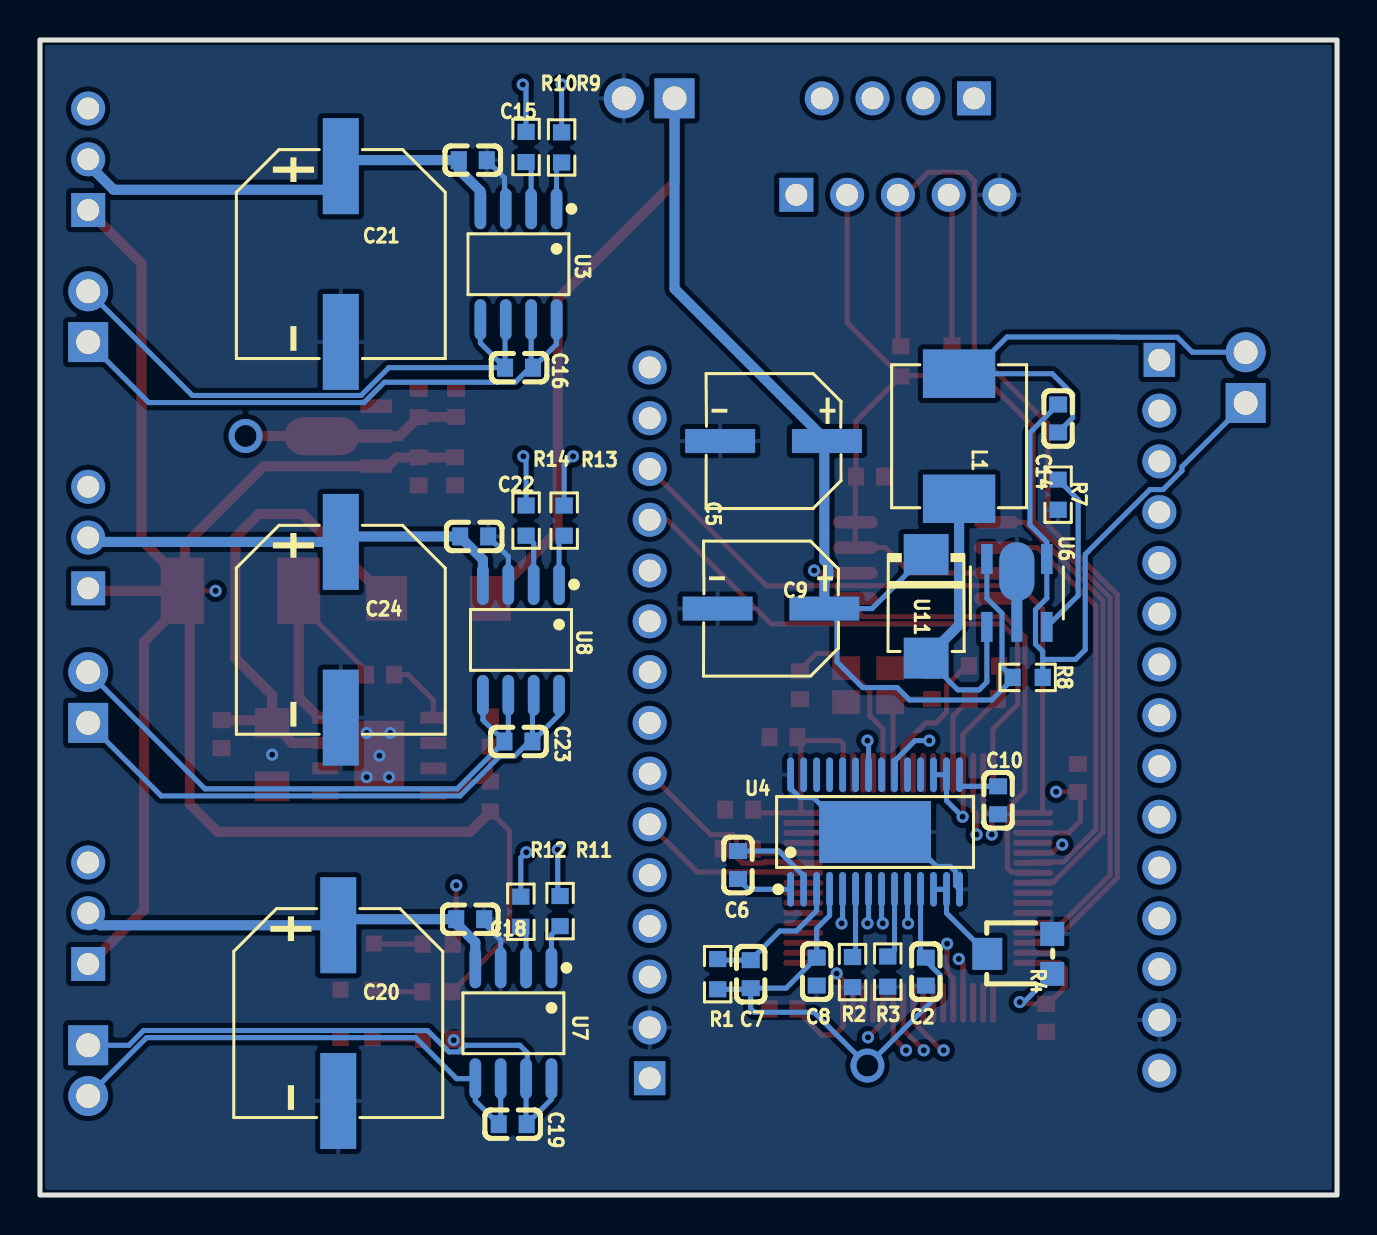
[diagram p2: board, bottom side, seen from below]

Outline 64.9 x 57.78 mm; copper layers: Top Layer, Inner1, Inner2, Inner3, Inner4, Bottom Layer. Coordinates in mm from the lower left corner of the outline.
Outline path: rectangle 0,57.78 64.9,0
Stack: Top Layer 0.035mm 外层铜厚1oz / Dielectric1 0.0994mm 3313 RC57% 4.2mil / Inner1 0.0152mm 内层铜厚 / Dielectric2 0.55mm 0.55mm H/H No copper / Inner2 0.0152mm 内层铜厚 / Dielectric3 0.1088mm 2116 RC54% 4.9mil / Inner3 0.0152mm 内层铜厚 / Dielectric4 0.55mm 0.55mm H/H No copper / Inner4 0.0152mm 内层铜厚 / Dielectric5 0.0994mm 3313 RC57% 4.2mil / Bottom Layer 0.035mm 外层铜厚1oz

## Design rules (mm)
template: JLCPCB Capability(Two Layers Board)
spacing copperThickness1oz (default): track to track 0.102, other pairs 0.152 to 0.3
spacing copperThickness2oz: track to track 0.203, other pairs 0.152 to 0.3
track width copperThickness1oz (default): min 0.127, default 0.254, max 2.54
track width copperThickness2oz: min 0.203, default 0.254, max 2.54
differential pair differentialPair (default): width min 0.127, default 0.254, max 2.54; gap min 0.152, default 0.152
via viaSize (default): diameter min 0.5, default 0.61, max 10; hole min 0.3, default 0.305, max 6.3

## Placement (name value [footprint] x y rotation side)
C2  100nF  [C0603]  20.57 11.18 90 bottom
C5  100uF  [CAP-SMD_BD6.3-L6.6-W6.6-LS7.3-FD-H7.7]  28.19 37.72 0 bottom
C6  10nF  [C0603]  29.97 16.51 90 bottom
C7  100nF  [C0603]  29.34 11.05 90 bottom
C8  100nF  [C0603]  26.03 11.18 270 bottom
C9  100uF  [CAP-SMD_BD6.3-L6.6-W6.6-LS7.3-FD-H7.7]  28.32 29.34 0 bottom
C10  470nF  [C0603]  16.96 19.75 90 bottom
C11  10pF  [C0603]  26.87 25.51 270 top
C12  10pF  [C0603]  20.27 25.51 270 top
C13  100nF  [C0603]  12.97 20.87 90 top
C14  100nF  [C0603]  13.96 38.85 90 bottom
C15  100nF  [C0603]  43.24 51.77 0 bottom
C16  100nF  [C0603]  40.93 41.39 180 bottom
C17  100nF  [C0603]  44.13 36.2 90 top
C18  100nF  [C0603]  43.37 13.8 0 bottom
C19  100nF  [C0603]  41.25 3.55 180 bottom
C20  470uF  [CAP-SMD_BD10.0-L10.3-W10.3-LS11.0-R-RD]  49.97 9.1 90 bottom
C21  470uF  [CAP-SMD_BD10.0-L10.3-W10.3-LS11.0-R-RD]  49.85 47.07 90 bottom
C22  100nF  [C0603]  43.17 32.95 0 bottom
C23  100nF  [C0603]  40.96 22.69 180 bottom
C24  470uF  [CAP-SMD_BD10.0-L10.3-W10.3-LS11.0-R-RD]  49.85 28.28 90 bottom
C26  100nF  [C0603]  55.81 23.05 90 top
C27  10uF  [C1206]  53.28 22.03 90 top
C28  10nF  [C0603]  47.88 26.03 0 top
C29  1uF  [C0603]  45.95 36.2 270 top
C30  1uF  [C0603]  44.08 39.62 90 top
C31  100nF  [C0603]  45.95 39.62 270 top
C35  100nF  [C0603]  14.55 8.87 90 top
C36  100nF  [C0603]  17.67 24.81 0 top
C42  100nF  [C0603]  27.7 22.9 180 top
C43  100nF  [C0603]  27.7 9.31 180 top
C44  100nF  [C0603]  29.92 19.28 180 top
C45  100nF  [C0603]  23.37 35.94 0 top
H1  PZ254V-11-02P  [HDR-TH_2P-P2.54-V-M]  62.48 6.22 270 top
H2  PZ254V-11-02P  [HDR-TH_2P-P2.54-V-M]  62.48 43.94 90 top
H3  PZ254V-11-02P  [HDR-TH_2P-P2.54-V-M]  62.48 24.89 90 top
H4  PZ254V-11-04P  [HDR-TH_4P-P2.54-V-M]  21.97 54.86 0 top
H5  PZ254V-11-02P  [HDR-TH_2P-P2.54-V-M]  4.57 40.89 90 top
H6  PZ254V-11-03P  [HDR-TH_3P-P2.54-V-M]  62.48 14.1 90 top
H8  PZ254V-11-03P  [HDR-TH_3P-P2.54-V-M]  62.48 32.89 90 top
H9  PZ254V-11-03P  [HDR-TH_3P-P2.54-V-M]  62.48 51.82 90 top
H10  PZ254V-11-05P  [HDR-TH_5P-P2.54-V-M]  21.97 50.04 180 top
H11  PZ254V-11-02P  [HDR-TH_2P-P2.54-V-M]  34.42 54.86 0 top
L1  47uH  [IND-SMD_L7.0-W6.6_FXL0630]  18.91 37.96 90 bottom
L2  22uH  [IND-SMD_L7.1-W6.6]  54.86 30.23 0 top
LED1  XL-1608UGC-04  [LED0603-RD_GREEN]  49.06 10.27 180 top
LED2  KT-0603R  [LED0603-RD]  49 12.58 180 top
LED3  XL-1608UBC-04  [LED0603-RD_BLUE]  49.06 7.85 180 top
Q1  AMS1117-3.3V  [SOT-89-3_L4.5-W2.5-P1.50-LS4.2-BR]  49.43 37.96 180 top
R1  1MΩ  [R0603]  30.99 11.05 90 bottom
R2  200mΩ  [R0603]  24.24 11.15 90 bottom
R3  200mΩ  [R0603]  22.48 11.18 90 bottom
R4  10kΩ  [RES-ADJ-SMD_JER33X-1-14]  15.88 12.06 90 bottom
R7  10kΩ  [R0603]  13.96 35.04 90 bottom
R8  200mΩ  [R0603]  15.48 25.89 0 bottom
R9  300Ω  [R0603]  38.8 52.41 270 bottom
R10  300Ω  [R0603]  40.58 52.43 270 bottom
R11  300Ω  [R0603]  38.88 14.2 270 bottom
R12  300Ω  [R0603]  40.84 14.17 270 bottom
R13  300Ω  [R0603]  38.67 33.74 270 bottom
R14  300Ω  [R0603]  40.57 33.74 270 bottom
R15  10kΩ  [R0603]  21.82 41.71 270 top
R16  10kΩ  [R0603]  19.27 41.75 90 top
R17  3.24kΩ  [R0603]  42.36 23.19 270 top
R18  10kΩ  [R0603]  42.36 19.94 270 top
R19  100Ω  [R0603]  45.02 10.17 180 top
R20  470Ω  [R0603]  44.98 7.79 180 top
R21  49.9Ω  [R0603]  45 12.55 180 top
R22  10kΩ  [R0603]  29.98 17.32 180 top
R23  10kΩ  [R0603]  17.66 26.48 0 top
U1  STM32F103RCT7  [LQFP-64_L10.0-W10.0-P0.50-LS12.0-BL]  20.96 15.37 180 top
U3  RZ7899-MS  [SOIC-8_L4.9-W3.9-P1.27-LS6.0-BL]  40.96 46.57 0 bottom
U4  DRV8825PWPR  [HTSSOP-28_L9.7-W4.4-P0.65-LS6.4-BL-EP]  23.11 18.16 180 bottom
U5  W25Q64JVSSIQ  [SOIC-8_L5.3-W5.3-P1.27-LS8.0-BL]  20.57 31.75 270 top
U6  PT4115  [SOT-89-5_L4.5-W2.5-P1.50-LS4.5-BR]  16.02 30.12 270 bottom
U7  RZ7899-MS  [SOIC-8_L4.9-W3.9-P1.27-LS6.0-BL]  41.21 8.59 0 bottom
U8  RZ7899-MS  [SOIC-8_L4.9-W3.9-P1.27-LS6.0-BL]  40.83 27.77 0 bottom
U10  TPS5430DDAR  [ESOP-8_L4.9-W3.9-P1.27-LS6.0-TL-EP]  47.91 21.98 0 top
U11  SS54  [SMB_L4.3-W3.6-LS5.4-RD]  20.56 29.45 270 bottom
U12  SS54  [SMB_L4.3-W3.6-LS5.4-RD]  44.96 29.84 180 top
U13  ZX-PM2.54-1-15PY  [HDR-TH_15P-P2.54-V-F]  8.89 24 270 top
U14  ZX-PM2.54-1-15PY  [HDR-TH_15P-P2.54-V-F]  34.39 23.62 90 top
X2  8MHz  [CRYSTAL-SMD_4P-L3.2-W2.5-BL]  23.46 25.51 180 top

## Footprints (pads in the part's own frame, mm; a bottom-side part is the same pattern mirrored in y, then rotated)
C0603
  rect 0.8x0.9 smd: 1(-0.7,0) 2(0.7,0)
C1206
  rect 1.485x1.728 smd: 1(-1.593,0) 2(1.593,0)
CAP-SMD_BD6.3-L6.6-W6.6-LS7.3-FD-H7.7
  rect 3.5x1.2 smd: 1(-2.67,0) 2(2.67,0)
CAP-SMD_BD10.0-L10.3-W10.3-LS11.0-R-RD
  rect 4.8x1.8 smd: 1(4.395,0) 2(-4.395,0)
CRYSTAL-SMD_4P-L3.2-W2.5-BL
  rect 1.4x1.2 smd: 1(-1.1,-0.85) 2(1.1,-0.85) 3(1.1,0.85) 4(-1.1,0.85)
ESOP-8_L4.9-W3.9-P1.27-LS6.0-TL-EP
  rect 1.3x0.6 smd: 1(-2.7,1.905) 2(-2.7,0.635) 3(-2.7,-0.635) 4(-2.7,-1.905) 5(2.7,-1.905) 6(2.7,-0.635) 7(2.7,0.635) 8(2.7,1.905)
  rect 2.5x3.5 smd: 9(0,0)
HDR-TH_2P-P2.54-V-M
  rect 2x2 hole 1.2: 1(-1.27,0)
  round 2 hole 1.2: 2(1.27,0)
HDR-TH_3P-P2.54-V-M
  rect 1.7x1.7 hole 1.1: 1(-2.54,0)
  round 1.7 hole 1.1: 2(0,0) 3(2.54,0)
HDR-TH_4P-P2.54-V-M
  rect 1.7x1.7 hole 1.1: 1(-3.81,0)
  round 1.7 hole 1.1: 2(-1.27,0) 3(1.27,0) 4(3.81,0)
HDR-TH_5P-P2.54-V-M
  rect 1.7x1.7 hole 1.1: 1(-5.08,0)
  round 1.7 hole 1.1: 2(-2.54,0) 3(0,0) 4(2.54,0) 5(5.08,0)
HDR-TH_15P-P2.54-V-F
  rect 1.7x1.575 hole 1.1: 1(-17.78,0)
  round 1.7 hole 1.1: 2(-15.24,0) 3(-12.7,0) 4(-10.16,0) 5(-7.62,0) 6(-5.08,0) 7(-2.54,0) 8(0,0) 9(2.54,0) 10(5.08,0) 11(7.62,0) 12(10.16,0) 13(12.7,0) 14(15.24,0) 15(17.78,0)
HTSSOP-28_L9.7-W4.4-P0.65-LS6.4-BL-EP
  oval 0.343x1.732 smd: 1(-4.225,-2.866) 2(-3.575,-2.866) 3(-2.925,-2.866) 4(-2.275,-2.866) 5(-1.625,-2.866) 6(-0.975,-2.866) 7(-0.325,-2.866) 8(0.325,-2.866) 9(0.975,-2.866) 10(1.625,-2.866) 11(2.275,-2.866) 12(2.925,-2.866) 13(3.575,-2.866) 14(4.225,-2.866) 15(4.225,2.866) 16(3.575,2.866) 17(2.925,2.866) 18(2.275,2.866) 19(1.625,2.866) 20(0.975,2.866) 21(0.325,2.866) 22(-0.325,2.866) 23(-0.975,2.866) 24(-1.625,2.866) 25(-2.275,2.866) 26(-2.925,2.866) 27(-3.575,2.866) 28(-4.225,2.866)
  rect 5.6x3.1 smd: 29(0,0)
IND-SMD_L7.0-W6.6_FXL0630
  rect 2.424x3.62 smd: 1(3.128,0) 2(-3.128,0)
IND-SMD_L7.1-W6.6
  rect 2.15x3.32 smd: 1(-2.913,0) 2(2.913,0)
LED0603-RD
  rect 0.8x0.8 smd: 1(-0.799,0) 2(0.799,0)
LED0603-RD_BLUE
  rect 0.8x0.8 smd: 1(-0.799,-0.004) 2(0.799,0.004)
LED0603-RD_GREEN
  rect 0.8x0.8 smd: 1(-0.799,-0.004) 2(0.799,0.004)
LQFP-64_L10.0-W10.0-P0.50-LS12.0-BL
  oval 0.3x2 smd: 1(-3.75,-5.75) 2(-3.25,-5.75) 3(-2.75,-5.75) 4(-2.25,-5.75) 5(-1.75,-5.75) 6(-1.25,-5.75) 7(-0.75,-5.75) 8(-0.25,-5.75) 9(0.25,-5.75) 10(0.75,-5.75) 11(1.25,-5.75) 12(1.75,-5.75) 13(2.25,-5.75) 14(2.75,-5.75) 15(3.25,-5.75) 16(3.75,-5.75) 33(3.75,5.75) 34(3.25,5.75) 35(2.75,5.75) 36(2.25,5.75) 37(1.75,5.75) 38(1.25,5.75) 39(0.75,5.75) 40(0.25,5.75) 41(-0.25,5.75) 42(-0.75,5.75) 43(-1.25,5.75) 44(-1.75,5.75) 45(-2.25,5.75) 46(-2.75,5.75) 47(-3.25,5.75) 48(-3.75,5.75)
  oval 2x0.3 smd: 17(5.75,-3.75) 18(5.75,-3.25) 19(5.75,-2.75) 20(5.75,-2.25) 21(5.75,-1.75) 22(5.75,-1.25) 23(5.75,-0.75) 24(5.75,-0.25) 25(5.75,0.25) 26(5.75,0.75) 27(5.75,1.25) 28(5.75,1.75) 29(5.75,2.25) 30(5.75,2.75) 31(5.75,3.25) 32(5.75,3.75) 49(-5.75,3.75) 50(-5.75,3.25) 51(-5.75,2.75) 52(-5.75,2.25) 53(-5.75,1.75) 54(-5.75,1.25) 55(-5.75,0.75) 56(-5.75,0.25) 57(-5.75,-0.25) 58(-5.75,-0.75) 59(-5.75,-1.25) 60(-5.75,-1.75) 61(-5.75,-2.25) 62(-5.75,-2.75) 63(-5.75,-3.25) 64(-5.75,-3.75)
R0603
  rect 0.806x0.864 smd: 1(-0.753,0) 2(0.753,0)
RES-ADJ-SMD_JER33X-1-14
  rect 1.2x1.2 smd: 1(1,-1.625) 3(-1,-1.625)
  rect 1.6x1.5 smd: 2(0,1.625)
SMB_L4.3-W3.6-LS5.4-RD
  rect 2.047x2.241 smd: 1(-2.591,0) 2(2.591,0)
SOIC-8_L4.9-W3.9-P1.27-LS6.0-BL
  oval 0.588x2.045 smd: 1(-1.905,-2.772) 2(-0.635,-2.772) 3(0.635,-2.772) 4(1.905,-2.772) 5(1.905,2.772) 6(0.635,2.772) 7(-0.635,2.772) 8(-1.905,2.772)
SOIC-8_L5.3-W5.3-P1.27-LS8.0-BL
  oval 0.63x2.25 smd: 1(-1.905,-3.53) 2(-0.635,-3.53) 3(0.635,-3.53) 4(1.905,-3.53) 5(1.905,3.53) 6(0.635,3.53) 7(-0.635,3.53) 8(-1.905,3.53)
SOT-89-3_L4.5-W2.5-P1.50-LS4.2-BR
  rect 1.575x0.672 smd: 1(1.356,-1.5) 3(1.356,1.5)
  custom 5.377x1.9 smd: 2(-1.356,0)
SOT-89-5_L4.5-W2.5-P1.50-LS4.5-BR
  rect 1.5x0.574 smd: 1(1.698,-1.5) 3(1.698,1.5) 4(-1.698,1.5) 5(-1.698,-1.5)
  oval 2.94x1.76 smd: 2(-1.067,0)
  rect 2.209x0.552 smd: 2(1.343,0)

## Nets
As in the schematic.

Pads without a net: U1 2 3 4 8 9 10 11 20 25 26 27 28 33 34 35 38 39 40 45 46 49 50 51 52 53 54 55 56 57 62; U4 18 19 21 23 24 25 26 27; U10 2 3 5; U13 1 2 3 4 5 6 7 8 9 10 11 12 13; U14 1 3 4 5 8 9 10 11 14 15

## Via types
v1: diameter 0.61, hole 0.305, Top Layer to Bottom Layer, 35 vias
v2: diameter 1.7, hole 1.1, Top Layer to Bottom Layer, 2 vias

## Routing (per net, layer and track width the routed paths; a pad name or vN(x,y) marks a point on that pad's centre or on a via; arc(x,y) is an arc through that point)
3V3: length 230
  Top Layer w0.254: 26.83,22.73 C42.2 ; 26.83,22.73 26.83,19.24 U1.64 29.06,19.12 C44.2 ; 26.83,22.73 24.89,22.73 24.71,22.55 U1.1 ; 12.84,20.04 12.84,18.71 13.43,18.12 U1.19 ; v1(14.05,20.17) C13.1 ; R16.1 21.78,41 R15.2 ; R15.2 24.51,43.64 H10.2 ; R15.2 24.07,38.71 C45.2 24.1,35.9 U5.8 U5.7 22.61,32.38 21.34,31.11 U5.3 ; v1(15.88,9.65) 15.79,9.57 C35.2 14.43,9.57 13.59,10.41 13.59,11.3 13.9,11.62 U1.32 ; C43.2 27,9.22 25.78,8 25.15,8 24.71,8.44 U1.48 24.71,10.73 25.03,11.06 v1(25.03,11.08) ; U1.13 18.71,18.95 v1(18.74,18.92) ; 18.72,21.16 18.72,23.06 C36.1 16.91,24.86 R23.1 ; R21.2 44.07,12.73 v1(44.07,15.49)
  Top Layer w0.508: v2(54.61,37.97) 50.79,37.97 Q1.2 46.91,37.96 C31.2 44.08,38.92 C30.1
  Inner3 w0.254: v2(54.61,37.97) 36.31,19.67 25.97,19.67 25.13,18.83 18.83,18.83 v1(18.74,18.92) ; v2(54.61,37.97) 54.79,38.15 56.08,38.15 57.15,37.08 57.15,28.57 v1(44.07,15.49) 39.66,11.08 35.83,11.08 34.86,12.05 33.92,12.05 32.96,11.08 v1(25.03,11.08) ; v2(54.61,37.97) 40.13,37.97 34.04,44.07 30.93,44.07 24.96,50.04 H10.2 ; v1(14.05,20.17) 16.02,20.17 17.27,18.92 v1(18.74,18.92) ; v1(18.74,18.92) 18.74,12.51 v1(15.88,9.65)
  Bottom Layer w0.254: U4.17 U4.16 19.54,19.73 v1(18.74,18.92) ; R4.3 15.66,9.65 v1(15.88,9.65)
5V: length 202.5
  Top Layer w0.254: R18.2 41.4,18.23 41.4,13.03 R19.2 ; v1(56.11,30.23) 57.48,30.23
  Top Layer w0.508: 57.78,30.23 57.48,30.23 57.4,30.15 57.4,19.56 56.01,18.17 43.38,18.17 R18.2 ; 57.78,30.23 62.36,30.23 H8.1 ; 57.78,30.23 57.78,29.6 59.69,27.69 59.69,14.28 62.41,11.56 H6.1 ; C17.2 C29.1 47.05,36.9 47.48,36.46 Q1.3 53.71,36.46 57.65,32.52 57.65,30.73 ; 57.78,30.73 59.82,32.77 59.82,46.61 62.48,49.28
  Inner2 w0.508: U13.15 11.56,3.56 35.94,3.56 56.11,23.72 v1(56.11,30.23) 36.3,50.04 H10.1
12V: length 311
  Top Layer w0.254: v1(44.2,7.75) 44.2,7.76 R20.2
  Top Layer w0.508: U12.2 38.99,33.22 38.99,44.83 33.15,50.67 H11.1
  Inner1 w0.254: v1(44.2,7.75) 53.28,7.75 62.33,16.8
  Inner1 w0.762: H11.1 35.18,56.9 59.94,56.9 H9.3 ; H11.1 31.12,52.83 31.12,48.01 H6.3 ; H11.1 33.15,54.74 37.21,50.67 47.24,50.67 H8.3 ; H11.1 33.15,54.99 31.62,56.51 29.72,56.51 28.96,55.75 28.96,12.06 23.5,6.6 v2(23.5,6.48)
  Bottom Layer w0.254: 25.25,29.34 23.27,29.34 U11.1 ; 25.25,29.34 25.25,28.96 25.02,28.73 25.02,26.67 23.74,25.39 22.01,25.39 21.38,24.76 17.28,24.76 16.23,25.81 R8.2 16.76,26.43 16.76,29.1 17.52,29.86 U6.5 ; 25.25,29.34 C9.1 ; C7.1 27.56,10.35 C8.1 26.03,13.33 25.39,13.98 U4.4 ; C7.1 29.34,9.32 29.16,9.14 26.16,9.14 v2(23.5,6.48) 20.18,9.8 20.01,9.8 19.84,9.96 19.84,10.99 20.57,11.72 C2.2 20.64,11.88 20.84,12.08 U4.11 ; C7.1 29.39,10.3 R1.1
  Bottom Layer w0.508: C9.1 25.65,30.75 25.45,30.95 25.45,31.54 25.65,31.74 25.65,37.59 C5.1 33.15,45.34 H11.1
GND: length 24
  Top Layer w0.254: C36.2 19.22,23.96 19.22,21.16
  Bottom Layer w0.254: 41.59,49.34 41.66,49.4 41.66,50.89 C15.1 ; U7.3 41.84,12.76 42.67,13.59 C18.1 ; U8.3 41.46,31.94 C22.1 ; U4.28 27.34,20.35 26.88,19.88 26.19,19.88 24.47,18.16 U4.29 21.75,18.16 20.03,16.44 19.35,16.44 19.09,16.18 19.09,15.49 U4.14
  vias: v1(47.37,23.11) v1(47.43,20.9) v1(47.91,21.98) v1(48.55,23.11) v1(48.55,20.9) v1(53.28,22.03)
A1: length 52.4
  Inner4 w0.254: v1(24.79,13.59) 24.32,13.59 23.74,13 23.47,13 23.12,12.65 21.07,12.65 19.32,14.4 19.32,19.16 18.98,19.51 18.87,19.51 15.49,22.88 15.49,50.24 16.42,51.17 17.86,51.17 18.16,51.47 H4.1
  Bottom Layer w0.254: U4.5 24.74,13.64 v1(24.79,13.59)
A2: length 48.3
  Inner4 w0.254: H4.2 20.32,54.48 20.32,52.52 18.3,50.51 18.3,24.01 20.32,21.99 20.32,14.35 20.88,13.79 20.88,13.35 21.22,13 22.97,13 23.31,13.35 23.31,13.41 v1(23.5,13.59)
  Bottom Layer w0.254: v1(23.5,13.59) 23.44,13.64 U4.7
B1: length 44.6
  Inner4 w0.254: H4.3 21.46,53.09 21.46,51.13 20.84,50.51 20.84,49.57 21.87,48.55 21.87,16.76 21.46,16.36 v1(21.46,13.59)
  Bottom Layer w0.254: U4.10 21.49,13.61 v1(21.46,13.59)
B2: length 44.3
  Inner4 w0.254: v1(22.73,13.59) 22.91,13.77 22.91,13.83 23.25,14.17 23.31,14.17 25.58,16.44 25.58,31.48 25.78,31.69 H4.4
  Bottom Layer w0.254: v1(22.73,13.59) 22.79,13.65 22.79,15.29
BI_MT: length 29.7
  Top Layer w0.254: v1(20.68,7.24) 21.71,8.27 U1.42
  Inner4 w0.254: v1(20.68,7.24) 20.74,7.24 22.63,5.35 23.96,5.35 30.95,12.33 34.86,12.33 35.52,12.99 35.52,13.8 v1(38.99,17.27)
  Bottom Layer w0.254: 38.88,14.96 38.99,15.07 v1(38.99,17.27)
BI_SOL: length 57.1
  Top Layer w0.254: v1(17.27,18.03) 17.27,18.92 17.71,19.36 U1.15
  Inner2 w0.254: v1(17.27,18.03) 17.27,34.03 25.92,42.68 25.92,51 26.09,51.17 28.02,51.17 28.18,51 34.25,51 v1(38.8,55.55)
  Bottom Layer w0.254: R9.1 v1(38.8,55.55)
BI_WIND: length 40.6
  Top Layer w0.254: v1(23.47,7.89) 22.71,8.65 U1.44
  Inner4 w0.254: v1(23.47,7.89) 33.26,17.68 33.26,19.01 33.92,19.67 35.25,19.67 38.23,22.65 v1(38.23,36.96)
  Bottom Layer w0.254: v1(38.23,36.96) 38.67,36.51 R13.1
CS: length 23.1
  Top Layer w0.254: U5.1 15.62,33.65 11.71,29.74 11.71,18.14 14.19,15.66 15.22,15.66
DIM: length 8.4
  Bottom Layer w0.254: U6.3 12.95,29.99 12.95,34.79 R7.2
DIR: length 16.6
  Top Layer w0.254: 18.72,9.66 18.72,11.6 v1(18.92,11.81)
  Inner1 w0.254: v1(18.92,11.81) 18.93,11.81 18.93,17.91 20.4,19.39 v1(20.4,22.73)
  Bottom Layer w0.254: v1(20.4,22.73) 21.11,22.73 22.14,21.71 U4.20
FI_MT: length 33.2
  Top Layer w0.254: v1(19.69,7.24) 19.78,7.24 21.21,8.66 ; 21.21,8.66 U1.41 ; 21.21,8.66 21.2,8.67
  Inner4 w0.254: v1(19.69,7.24) 19.85,7.24 22.1,4.99 24.11,4.99 28.91,9.79 34.86,9.79 35.52,10.45 35.52,12.1 v1(40.56,17.14)
  Bottom Layer w0.254: R12.1 40.84,16.87 v1(40.56,17.14)
FI_SOL: length 63.1
  Top Layer w0.254: U1.14 18.21,19.22 18.03,19.05 v1(18.03,18.03)
  Inner2 w0.254: v1(18.03,18.03) 18.03,17.97 17.51,17.45 17.03,17.45 16.66,17.82 16.66,42.85 23.38,49.57 23.38,50.51 24.4,51.52 28.16,51.52 28.33,51.36 34.1,51.36 38.21,55.47 38.21,55.8 38.56,56.14 39.04,56.14 39.62,55.55 v1(40.74,55.55)
  Bottom Layer w0.254: v1(40.74,55.55) 40.58,55.39 R10.1
FI_WIND: length 46.1
  Top Layer w0.254: v1(21.56,7.24) 22.21,7.88 U1.43
  Inner4 w0.254: v1(21.56,7.24) 24.82,10.5 25.28,10.5 32.91,18.13 32.91,21.19 33.92,22.21 34.86,22.21 37.64,24.99 37.64,37.2 37.99,37.54 38.47,37.54 39.05,36.96 v1(40.71,36.96)
  Bottom Layer w0.254: v1(40.71,36.96) 40.57,36.82 R14.1
LED+: length 33.4
  Bottom Layer w0.254: 14.73,26.79 14.73,27.2 15.09,27.56 15.09,29.29 14.52,29.86 U6.4 14.52,32.68 15.37,33.53 15.37,38.14 C14.2 ; 14.73,26.79 14.72,26.8 13.08,26.8 12.6,27.28 12.6,32.05 9.36,35.29 8.7,35.29 7.76,36.24 7.76,36.43 H5.1 ; 14.73,26.79 R8.1
LED-: length 23.2
  Bottom Layer w0.254: C14.1 13.23,38.88 13.23,40.06 14.25,41.09 18.35,41.09 ; 18.35,41.09 16.51,42.93 10.92,42.93 10.91,42.91 7.99,42.91 7.24,42.16 H5.2 ; 18.35,41.09 L1.1
MISO: length 21.2
  Top Layer w0.254: 15.22,16.66 13.69,16.66 12.06,18.29 12.06,29.46 14.99,32.38 U5.2
MOSI: length 22.9
  Top Layer w0.254: U5.5 24.1,29.31 23.72,28.93 16.62,28.93 15.62,27.93 15.62,20.22 16.5,19.34 16.5,16.37 16.29,16.16 15.22,16.16
OSC_IN: length 9
  Top Layer w0.254: 22.72,21.16 22.72,23.32 23.38,23.98 23.38,25.18 X2.1 25.3,27.09 26.05,27.09 26.87,26.27 C11.1
OSC_OUT: length 5.7
  Top Layer w0.254: C12.2 22.21,24.81 X2.3 22.22,24.51 22.22,21.16
SCK: length 22.6
  Top Layer w0.254: v1(13.75,17.53) 13.83,17.53 14.25,17.12 U1.21 ; U5.6 26.03,31.11 v1(26.16,31.24)
  Inner1 w0.254: v1(13.75,17.53) 13.75,18.83 v1(26.16,31.24)
SCL: length 42.4
  Top Layer w0.254: H10.4 19.27,49.87 R16.2 15.21,38.44 15.21,33.74 11.35,29.89 11.35,16.01 14.25,13.12 U1.29
SDA: length 55.5
  Top Layer w0.254: R15.1 21.97,42.61 H10.3 21.59,50.04 20.46,51.17 18.58,51.17 18.15,50.73 18.15,42.27 14.47,38.59 14.47,33.51 11,30.04 11,15.86 14.17,12.69 15.13,12.69 U1.30
STEP: length 16.6
  Top Layer w0.254: v1(19.51,12.57) 19.51,11.13 19.22,10.83 19.22,9.66
  Inner1 w0.254: v1(19.51,12.57) 23.19,16.25 23.19,19.58 23.5,19.89 v1(23.5,22.73)
  Bottom Layer w0.254: v1(23.5,22.73) 23.44,22.68 U4.22
USART1_RX: length 10.1
  Top Layer w0.254: 26.72,16.66 28.65,16.66 28.71,16.6 29.75,16.6 30.05,16.91 30.05,17.86 30.22,18.03 31.34,18.03 U14.7
USART1_TX: length 8.7
  Top Layer w0.254: 26.72,16.16 32.01,16.16 U14.6
USART2_RX: length 33.2
  Top Layer w0.254: U1.17 14.73,19.12 14.73,29.34 15.88,30.48 28.55,30.48 U14.13
USART2_TX: length 28
  Top Layer w0.254: 17.22,21.16 17.22,23.32 15.97,24.56 15.97,27.78 16.76,28.57 28.32,28.57 33.53,33.78 U14.12
VMAIN: length 21.8
  Bottom Layer w0.508: H6.2 61.88,13.5 49.97,13.5 49.97,13.8 C18.2 44.07,13.59 43.12,12.63 U7.4
VSOL: length 23.1
  Bottom Layer w0.508: U3.4 42.86,50.23 43.94,51.31 C15.2 49.54,51.77 C21.1 49.85,50.99 50.55,50.29 61.21,50.29 62.48,51.56 H9.2
VWIND: length 21.7
  Bottom Layer w0.508: H8.2 62.26,32.67 C24.1 49.57,32.95 C22.2 43.87,32.92 42.73,31.78 U8.4
$1N2321: length 4.5
  Bottom Layer w0.254: U4.2 26.69,15.98 27.92,17.21 C6.2
$1N2325: length 2.8
  Bottom Layer w0.254: C6.1 29.46,15.29 U4.1
$1N2438: length 7.1
  Bottom Layer w0.254: R1.2 30.93,11.75 C7.2 27.88,13.21 27.05,13.21 26.04,14.22 U4.3
$1N2602: length 3.5
  Bottom Layer w0.254: R2.2 24.09,12.06 U4.6
$1N2668: length 3.5
  Bottom Layer w0.254: R3.2 22.14,12.27 U4.9
$1N2883: length 4.7
  Bottom Layer w0.254: R4.2 19.54,14.1 U4.13 U4.12
$1N3097: length 2.5
  Bottom Layer w0.254: U4.15 18.89,20.45 C10.2
$1N4023: length 15.3
  Bottom Layer w0.254: U6.1 17.52,25.66 17.91,25.27 18.97,25.27 U11.2
  Bottom Layer w0.508: L1.2 18.91,28.51 U11.2
$1N5275: length 2.4
  Bottom Layer w0.254: 40.58,51.68 40.32,51.42 U3.2
$1N5279: length 2.4
  Bottom Layer w0.254: U3.1 39.05,51.4 R9.2
$1N5285: length 29.6
  Bottom Layer w0.254: H2.1 59.46,39.64 48.68,39.64 47.66,40.66 41.11,40.66 40.38,41.39 C16.2 ; C16.2 39.05,42.57 U3.8 ; C16.2 40.32,41.49 U3.7
$1N5289: length 28.9
  Bottom Layer w0.254: C16.1 42.86,42.63 U3.5 ; C16.1 47.44,41.39 48.83,40 57.27,40 H2.2 ; C16.1 41.63,43.76 41.59,43.79
$1N5836: length 2.2
  Bottom Layer w0.254: R12.2 40.57,13.16 U7.2
$1N5842: length 26.5
  Bottom Layer w0.254: H1.2 59.56,7.87 46.1,7.87 44.05,5.82 U7.5 43.12,4.71 C19.1 41.84,3.65 U7.6
$1N5850: length 29.4
  Bottom Layer w0.254: H1.1 60.45,7.49 59.71,8.23 45.5,8.23 44.44,7.16 43.95,7.16 43.62,7.49 40.89,7.49 40.51,7.11 40.51,5.88 U7.7 40.57,3.57 C19.2 39.31,4.79 U7.8
$1N5858: length 2.3
  Bottom Layer w0.254: U7.1 39.31,13.02 R11.2
$1N7602: length 29.4
  Bottom Layer w0.254: U8.5 42.73,23.77 C23.1 ; C23.1 44.03,20.32 56.64,20.32 H3.2 ; C23.1 41.46,22.88 U8.6
$1N7604: length 30.2
  Bottom Layer w0.254: 62.48,23.62 58.83,19.96 43.88,19.96 41.88,21.96 41.14,21.96 40.26,22.85 ; 40.06,22.88 40.22,22.88 40.26,22.85 ; 40.06,22.88 C23.2 ; 40.06,22.88 38.92,24.02 U8.8 ; 40.26,22.85 40.26,24.94 U8.7
$1N7613: length 2.5
  Bottom Layer w0.254: R13.2 38.92,32.73 U8.1
$1N7614: length 2.6
  Bottom Layer w0.254: R14.2 40.19,32.6 U8.2
$1N13952: length 25.5
  Top Layer w0.508: C27.2 52.27,22.61 U10.7 ; C27.2 53.28,25.02 55.12,26.86 55.12,32.89 53.94,34.07 51.77,34.07 U12.1 ; C27.2 53.41,23.75 55.81,23.75 C26.2
$1N14177: length 12
  Top Layer w0.254: 51.95,29.41 51.75,29.41 48.58,26.23 48.58,26.03
  Top Layer w0.508: L2.1 51.95,24.9 50.94,23.88 U10.8
$1N14184: length 3.4
  Top Layer w0.254: C28.1 46.48,26.03 45.21,24.76 U10.1
$1N14425: length 4.9
  Top Layer w0.254: R17.2 R18.1 43.32,20.69 43.93,20.07 U10.4
$1N14788: length 2.5
  Top Layer w0.254: R19.1 48.17,10.17 LED1.2
$1N17021: length 2.6
  Top Layer w0.254: R20.1 48.21,7.79 LED3.2
$1N17109: length 2.5
  Top Layer w0.254: LED2.2 48.16,12.55 R21.1
$1N17385: length 2.6
  Top Layer w0.254: 26.71,17.12 29.03,17.12 R22.2
$1N21131: length 7.1
  Top Layer w0.254: 21.72,21.16 21.72,22.48 20.57,23.62 20.07,23.62 19.54,24.15 19.54,25.48 18.54,26.48 18.42,26.48

## Copper pours and planes (outline as drawn; the poured copper is in the pictures)
GND on Top Layer: -5.97,73.79 77.72,73.79 77.72,-14.99 -5.97,-14.99
GND on Bottom Layer: -2.03,59.18 72.9,59.18 72.9,-8.64 -2.03,-8.64
GND on Inner1: -6.98,63.88 69.6,63.88 69.6,-7.62 -6.98,-7.62
GND on Inner2: -3.68,61.85 66.42,61.85 66.42,-4.19 -3.68,-4.19
GND on Inner3: -1.14,60.45 67.31,60.45 67.31,-3.18 -1.14,-3.18
GND on Inner4: -6.73,61.59 68.07,61.59 68.07,-8.25 -6.73,-8.25
